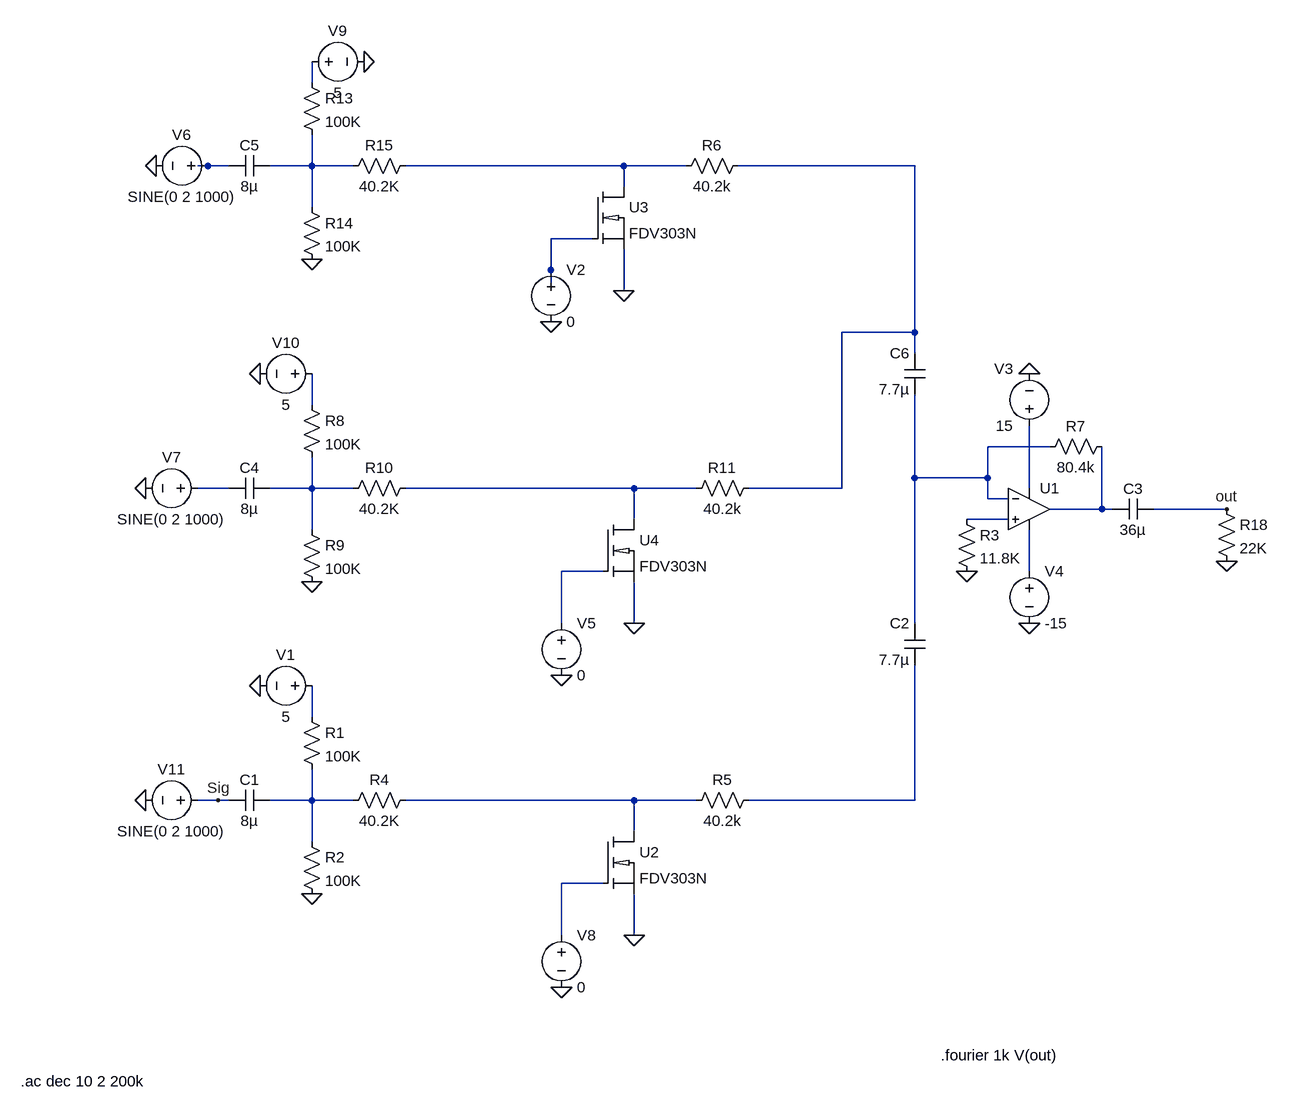
[diagram p0: schematic indgangsvaelger.asc]
indgangsvaelger.asc, the LTspice schematic file:
Version 4
SHEET 1 900 868
WIRE -608 -688 -608 -720
WIRE -768 -560 -784 -560
WIRE -736 -560 -768 -560
WIRE -608 -560 -608 -608
WIRE -608 -560 -672 -560
WIRE -544 -560 -608 -560
WIRE -128 -560 -464 -560
WIRE -32 -560 -128 -560
WIRE 320 -560 48 -560
WIRE -128 -528 -128 -560
WIRE -608 -496 -608 -560
WIRE -176 -448 -240 -448
WIRE -240 -400 -240 -448
WIRE -240 -368 -240 -400
WIRE -128 -368 -128 -432
WIRE 320 -304 320 -560
WIRE 320 -304 208 -304
WIRE 320 -272 320 -304
WIRE -608 -192 -608 -240
WIRE 528 -128 432 -128
WIRE 320 -80 320 -208
WIRE 432 -80 432 -128
WIRE 432 -80 320 -80
WIRE -736 -64 -784 -64
WIRE -608 -64 -608 -112
WIRE -608 -64 -672 -64
WIRE -544 -64 -608 -64
WIRE -112 -64 -464 -64
WIRE -16 -64 -112 -64
WIRE 208 -64 208 -304
WIRE 208 -64 64 -64
WIRE 496 -64 496 -160
WIRE 432 -48 432 -80
WIRE 464 -48 432 -48
WIRE 608 -32 608 -128
WIRE 608 -32 528 -32
WIRE 624 -32 608 -32
WIRE 800 -32 688 -32
WIRE -112 -16 -112 -64
WIRE 464 -16 400 -16
WIRE -608 0 -608 -64
WIRE -160 64 -224 64
WIRE 496 64 496 0
WIRE -224 144 -224 64
WIRE -112 144 -112 80
WIRE 320 144 320 -80
WIRE -608 288 -608 240
WIRE -752 416 -784 416
WIRE -736 416 -752 416
WIRE -608 416 -608 368
WIRE -608 416 -672 416
WIRE -544 416 -608 416
WIRE -112 416 -464 416
WIRE -16 416 -112 416
WIRE 320 416 320 208
WIRE 320 416 64 416
WIRE -112 464 -112 416
WIRE -608 480 -608 416
WIRE -160 544 -224 544
WIRE -224 624 -224 544
WIRE -112 624 -112 560
FLAG 496 144 0
FLAG 496 -240 0
FLAG 400 64 0
FLAG -608 80 0
FLAG -608 -416 0
FLAG 800 48 0
FLAG -528 -720 0
FLAG -688 -240 0
FLAG 800 -32 out
FLAG -128 -368 0
FLAG -240 -320 0
FLAG -112 144 0
FLAG -224 224 0
FLAG -848 -560 0
FLAG -864 -64 0
FLAG -608 560 0
FLAG -688 240 0
FLAG -112 624 0
FLAG -224 704 0
FLAG -864 416 0
FLAG -752 416 Sig
SYMBOL cap 336 208 R180
WINDOW 0 24 64 Left 0
WINDOW 3 24 8 Left 0
SYMATTR InstName C2
SYMATTR Value 7.7µ
SYMBOL cap 688 -48 R90
WINDOW 0 0 32 VBottom 0
WINDOW 3 32 32 VTop 0
SYMATTR InstName C3
SYMATTR Value 36µ
SYMBOL res 384 -32 R0
SYMATTR InstName R3
SYMATTR Value 11.8K
SYMBOL res 624 -144 R90
WINDOW 0 0 56 VBottom 0
WINDOW 3 32 56 VTop 0
SYMATTR InstName R7
SYMATTR Value 80.4k
SYMBOL voltage 496 -144 R180
WINDOW 0 24 104 Left 0
WINDOW 3 24 16 Left 0
WINDOW 123 0 0 Left 0
WINDOW 39 0 0 Left 0
SYMATTR InstName V3
SYMATTR Value 15
SYMBOL voltage 496 48 R0
WINDOW 123 0 0 Left 0
WINDOW 39 0 0 Left 0
SYMATTR InstName V4
SYMATTR Value -15
SYMBOL Opamps\\UniversalOpamp2 496 -32 R0
SYMATTR InstName U1
SYMBOL cap -672 -80 R90
WINDOW 0 0 32 VBottom 0
WINDOW 3 32 32 VTop 0
SYMATTR InstName C4
SYMATTR Value 8µ
SYMBOL res -624 -208 R0
SYMATTR InstName R8
SYMATTR Value 100K
SYMBOL res -624 -16 R0
SYMATTR InstName R9
SYMATTR Value 100K
SYMBOL res -448 -80 R90
WINDOW 0 0 56 VBottom 0
WINDOW 3 32 56 VTop 0
SYMATTR InstName R10
SYMATTR Value 40.2K
SYMBOL cap -672 -576 R90
WINDOW 0 0 32 VBottom 0
WINDOW 3 32 32 VTop 0
SYMATTR InstName C5
SYMATTR Value 8µ
SYMBOL res -624 -704 R0
SYMATTR InstName R13
SYMATTR Value 100K
SYMBOL res -624 -512 R0
SYMATTR InstName R14
SYMATTR Value 100K
SYMBOL res -448 -576 R90
WINDOW 0 0 56 VBottom 0
WINDOW 3 32 56 VTop 0
SYMATTR InstName R15
SYMATTR Value 40.2K
SYMBOL res 784 -48 R0
SYMATTR InstName R18
SYMATTR Value 22K
SYMBOL voltage -624 -720 R270
WINDOW 0 32 56 VTop 0
WINDOW 3 -32 56 VBottom 0
WINDOW 123 0 0 Left 0
WINDOW 39 0 0 Left 0
SYMATTR InstName V9
SYMATTR Value 5
SYMBOL voltage -592 -240 R90
WINDOW 0 -32 56 VBottom 0
WINDOW 3 32 56 VTop 0
WINDOW 123 0 0 Left 0
WINDOW 39 0 0 Left 0
SYMATTR InstName V10
SYMATTR Value 5
SYMBOL cap 336 -208 R180
WINDOW 0 24 64 Left 0
WINDOW 3 24 8 Left 0
SYMATTR InstName C6
SYMATTR Value 7.7µ
SYMBOL res 64 -576 R90
WINDOW 0 0 56 VBottom 0
WINDOW 3 32 56 VTop 0
SYMATTR InstName R6
SYMATTR Value 40.2k
SYMBOL voltage -240 -416 R0
WINDOW 123 0 0 Left 0
WINDOW 39 0 0 Left 0
SYMATTR InstName V2
SYMATTR Value 0
SYMBOL myLib\\FDV303 -176 -528 R0
SYMATTR InstName U3
SYMBOL res 80 -80 R90
WINDOW 0 0 56 VBottom 0
WINDOW 3 32 56 VTop 0
SYMATTR InstName R11
SYMATTR Value 40.2k
SYMBOL voltage -224 128 R0
WINDOW 123 0 0 Left 0
WINDOW 39 0 0 Left 0
SYMATTR InstName V5
SYMATTR Value 0
SYMBOL myLib\\FDV303 -160 -16 R0
SYMATTR InstName U4
SYMBOL voltage -752 -560 R90
WINDOW 0 -32 56 VBottom 0
WINDOW 3 32 56 VTop 0
SYMATTR InstName V6
SYMATTR Value SINE(0 2 1000)
SYMATTR Value2 AC 2
SYMATTR SpiceLine Rser=2.2k
SYMBOL voltage -768 -64 R90
WINDOW 0 -32 56 VBottom 0
WINDOW 3 32 56 VTop 0
SYMATTR InstName V7
SYMATTR Value SINE(0 2 1000)
SYMATTR Value2 AC 2
SYMATTR SpiceLine Rser=2.2k
SYMBOL cap -672 400 R90
WINDOW 0 0 32 VBottom 0
WINDOW 3 32 32 VTop 0
SYMATTR InstName C1
SYMATTR Value 8µ
SYMBOL res -624 272 R0
SYMATTR InstName R1
SYMATTR Value 100K
SYMBOL res -624 464 R0
SYMATTR InstName R2
SYMATTR Value 100K
SYMBOL res -448 400 R90
WINDOW 0 0 56 VBottom 0
WINDOW 3 32 56 VTop 0
SYMATTR InstName R4
SYMATTR Value 40.2K
SYMBOL voltage -592 240 R90
WINDOW 0 -32 56 VBottom 0
WINDOW 3 32 56 VTop 0
WINDOW 123 0 0 Left 0
WINDOW 39 0 0 Left 0
SYMATTR InstName V1
SYMATTR Value 5
SYMBOL res 80 400 R90
WINDOW 0 0 56 VBottom 0
WINDOW 3 32 56 VTop 0
SYMATTR InstName R5
SYMATTR Value 40.2k
SYMBOL voltage -224 608 R0
WINDOW 123 0 0 Left 0
WINDOW 39 0 0 Left 0
SYMATTR InstName V8
SYMATTR Value 0
SYMBOL myLib\\FDV303 -160 464 R0
SYMATTR InstName U2
SYMBOL voltage -768 416 R90
WINDOW 0 -32 56 VBottom 0
WINDOW 3 32 56 VTop 0
SYMATTR InstName V11
SYMATTR Value SINE(0 2 1000)
SYMATTR Value2 AC 2
SYMATTR SpiceLine Rser=2.2k
TEXT -1056 848 Left 0 !.ac dec 10 2 200k
TEXT 360 808 Left 0 !.fourier 1k V(out)

The netlist it stands for:
* indgangsvaelger.asc
C2 N020 N008 7.7µ
C3 out N013 36µ
R3 N014 0 11.8K
R7 N013 N008 80.4k
V3 N012 0 15
V4 N016 0 -15
XU1 N014 N008 N012 N016 N013 level.2 Avol=1Meg GBW=10Meg Slew=10Meg ilimit=25m rail=0 Vos=0 phimargin=45 en=0 enk=0 in=0 ink=0 Rin=500Meg  ; pins IN+ IN- V+ V- OUT
C4 N010 N009 8µ
R8 N007 N010 100K
R9 N010 0 100K
R10 N011 N010 40.2K
C5 N003 N002 8µ
R13 N001 N003 100K
R14 N003 0 100K
R15 N004 N003 40.2K
R18 out 0 22K
V9 N001 0 5
V10 N007 0 5
C6 N008 N005 7.7µ
R6 N005 N004 40.2k
V2 N006 0 0
XU3 N004 N006 0 FDV303N  ; pins D G S
R11 N005 N011 40.2k
V5 N015 0 0
XU4 N011 N015 0 FDV303N  ; pins D G S
V6 N002 0 SINE(0 2 1000) AC 2 Rser=2.2k
V7 N009 0 SINE(0 2 1000) AC 2 Rser=2.2k
C1 N018 Sig 8µ
R1 N017 N018 100K
R2 N018 0 100K
R4 N019 N018 40.2K
V1 N017 0 5
R5 N020 N019 40.2k
V8 N021 0 0
XU2 N019 N021 0 FDV303N  ; pins D G S
V11 Sig 0 SINE(0 2 1000) AC 2 Rser=2.2k
.ac dec 10 2 200k
.fourier 1k V(out)
.lib UniversalOpamps2.sub
.lib myLib\FDV303N.lib
.backanno
.end